# EAGLE schematic AxisNT_RF_PA (EAGLE 7.4.0)
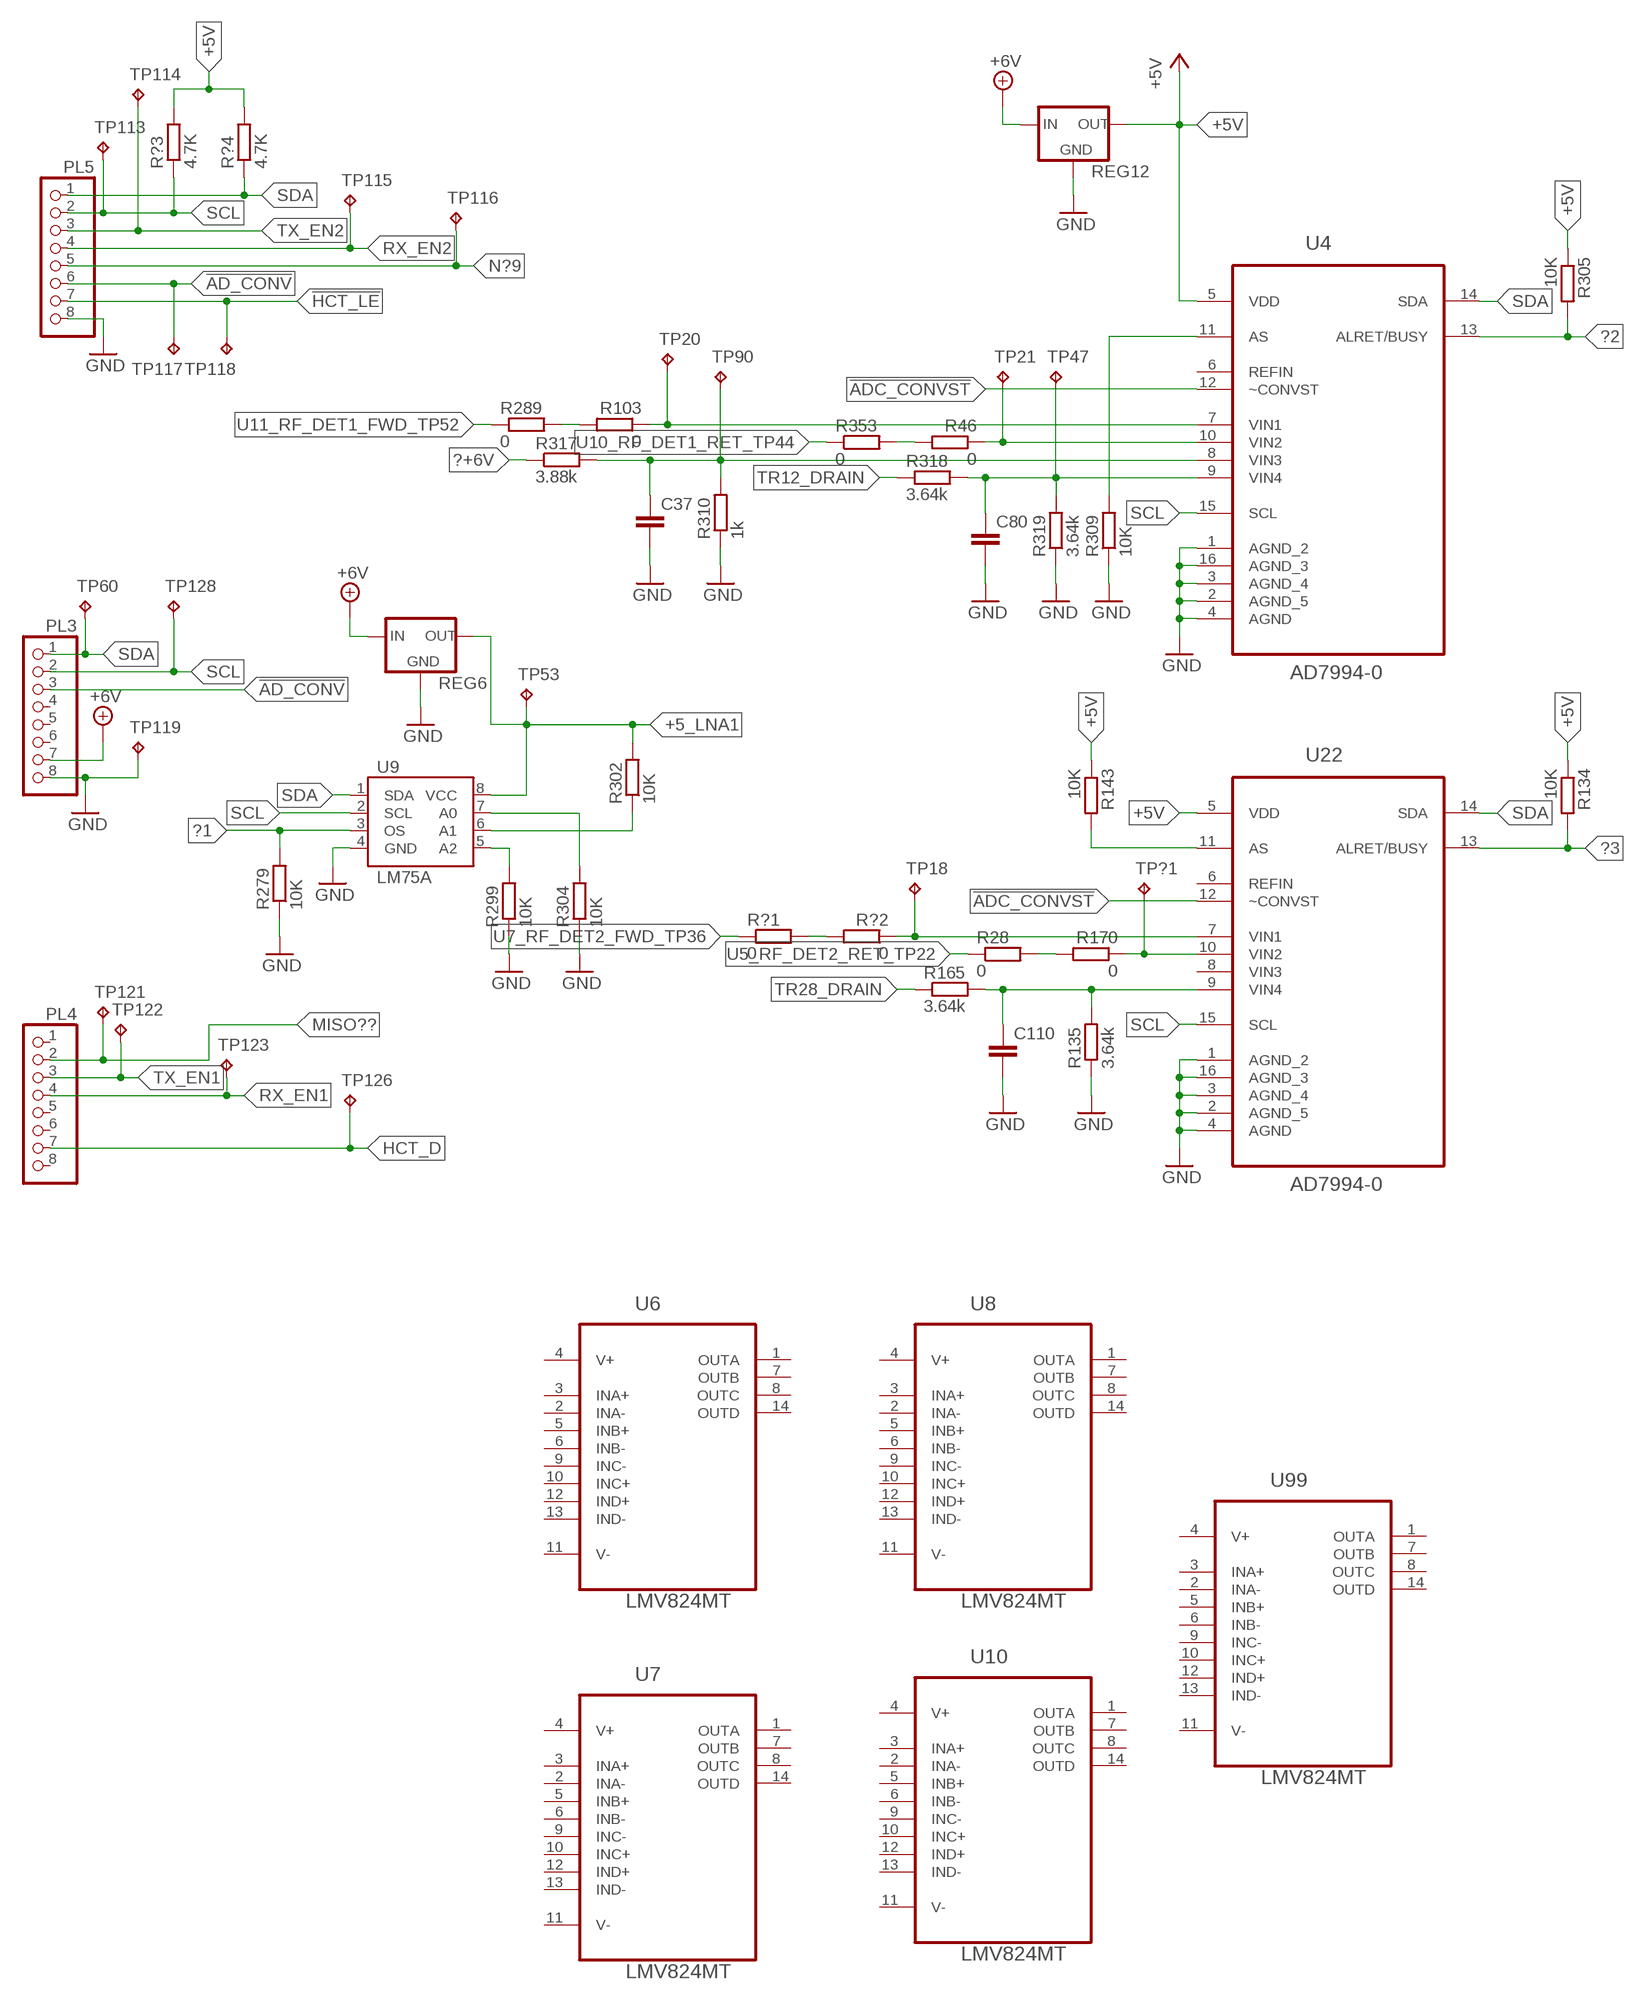
[diagram p0: schematic, sheet 1, part 1 of 2]
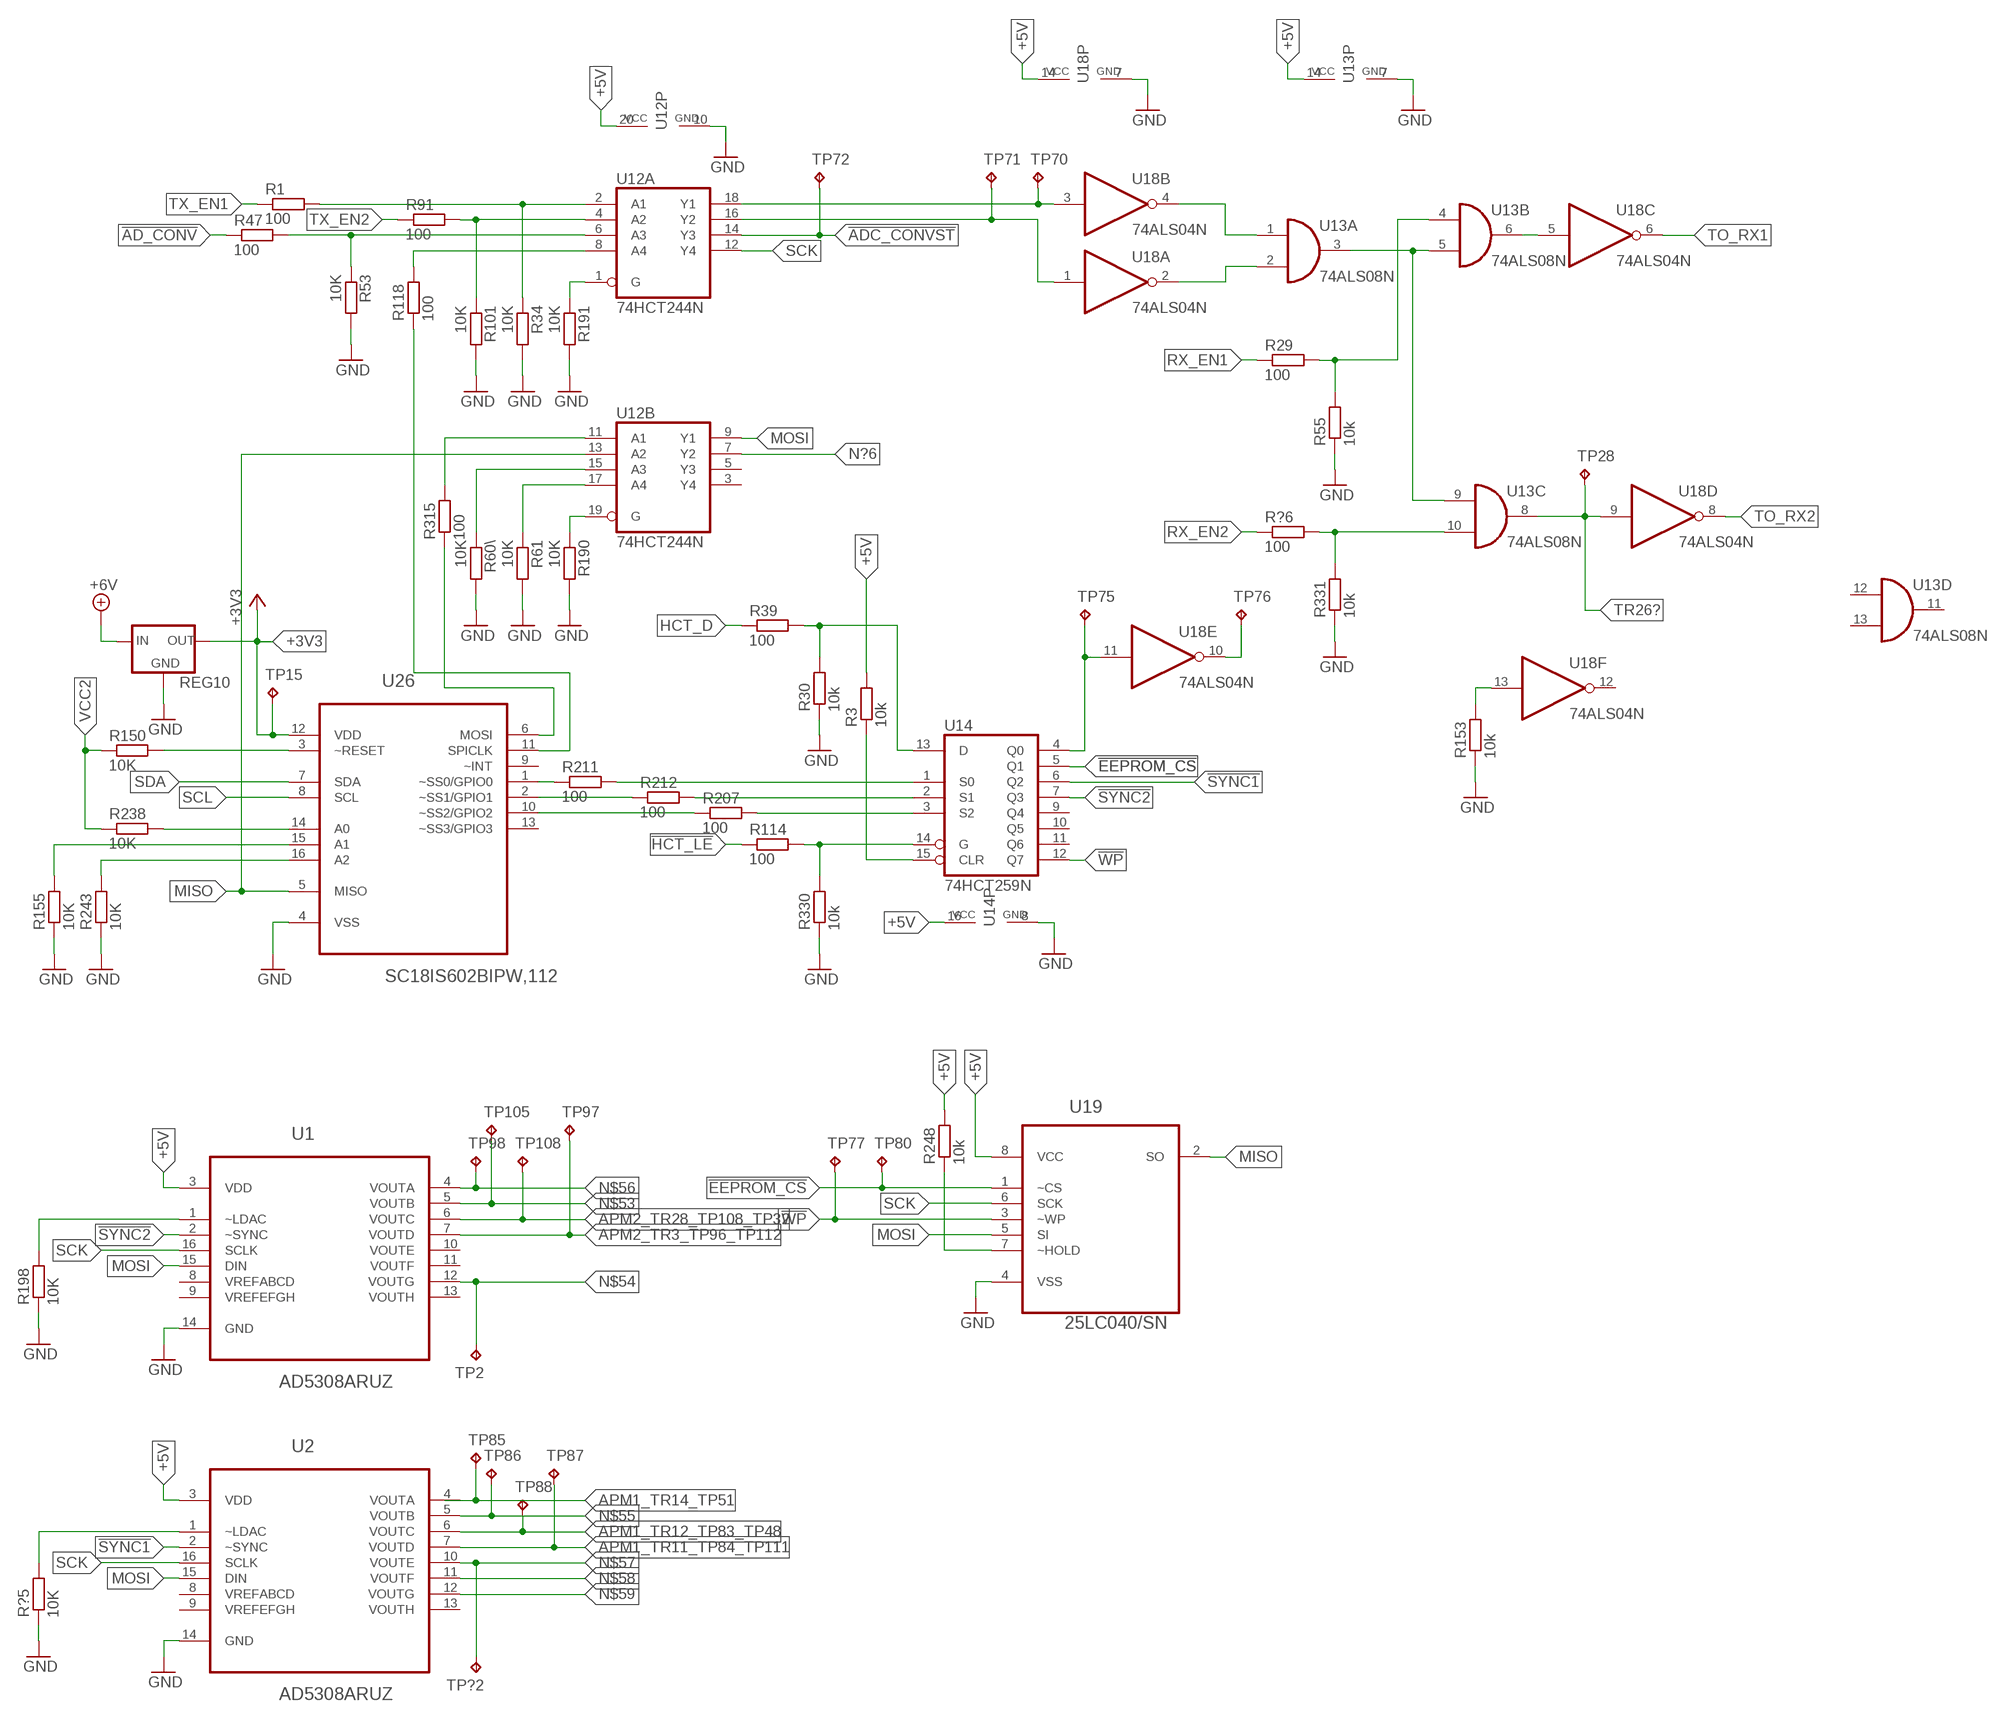
[diagram p1: schematic, sheet 1, part 2 of 2]

## Parts
C37  C-EUC0402  [C0402]
C80  C-EUC0402  [C0402]
C110  C-EUC0402  [C0402]
PL3  PINHD-1X8  [1X08]
PL4  PINHD-1X8  [1X08]
PL5  PINHD-1X8  [1X08]
R1  100  R-EU_R0402  [R0402]
R3  10k  R-EU_R0402  [R0402]
R28  0  R-EU_R0402  [R0402]
R29  100  R-EU_R0402  [R0402]
R30  10k  R-EU_R0402  [R0402]
R34  10K  R-EU_R0402  [R0402]
R39  100  R-EU_R0402  [R0402]
R46  0  R-EU_R0402  [R0402]
R47  100  R-EU_R0402  [R0402]
R53  10K  R-EU_R0402  [R0402]
R55  10k  R-EU_R0402  [R0402]
R60\  10K  R-EU_R0402  [R0402]
R61  10K  R-EU_R0402  [R0402]
R91  100  R-EU_R0402  [R0402]
R101  10K  R-EU_R0402  [R0402]
R103  0  R-EU_R0402  [R0402]
R114  100  R-EU_R0402  [R0402]
R118  100  R-EU_R0402  [R0402]
R134  10K  R-EU_R0402  [R0402]
R135  3.64k  R-EU_R0402  [R0402]
R143  10K  R-EU_R0402  [R0402]
R150  10K  R-EU_R0402  [R0402]
R153  10k  R-EU_R0402  [R0402]
R155  10K  R-EU_R0402  [R0402]
R165  3.64k  R-EU_R0402  [R0402]
R170  0  R-EU_R0402  [R0402]
R190  10K  R-EU_R0402  [R0402]
R191  10K  R-EU_R0402  [R0402]
R198  10K  R-EU_R0402  [R0402]
R207  100  R-EU_R0402  [R0402]
R211  100  R-EU_R0402  [R0402]
R212  100  R-EU_R0402  [R0402]
R238  10K  R-EU_R0402  [R0402]
R243  10K  R-EU_R0402  [R0402]
R248  10k  R-EU_R0402  [R0402]
R279  10K  R-EU_R0402  [R0402]
R289  0  R-EU_R0402  [R0402]
R299  10K  R-EU_R0402  [R0402]
R302  10K  R-EU_R0402  [R0402]
R304  10K  R-EU_R0402  [R0402]
R305  10K  R-EU_R0402  [R0402]
R309  10K  R-EU_R0402  [R0402]
R310  1k  R-EU_R0402  [R0402]
R315  100  R-EU_R0402  [R0402]
R317  3.88k  R-EU_R0402  [R0402]
R318  3.64k  R-EU_R0402  [R0402]
R319  3.64k  R-EU_R0402  [R0402]
R330  10k  R-EU_R0402  [R0402]
R331  10k  R-EU_R0402  [R0402]
R353  0  R-EU_R0402  [R0402]
R?1  0  R-EU_R0402  [R0402]
R?2  0  R-EU_R0402  [R0402]
R?3  4.7K  R-EU_R0402  [R0402]
R?4  4.7K  R-EU_R0402  [R0402]
R?5  10K  R-EU_R0402  [R0402]
R?6  100  R-EU_R0402  [R0402]
REG6  78LXX  [78LXX]
REG10  78LXX  [78LXX]
REG12  78LXX  [78LXX]
TP2  TPB1,27  [B1,27]
TP15  TPB1,27  [B1,27]
TP18  TPB1,27  [B1,27]
TP20  TPB1,27  [B1,27]
TP21  TPB1,27  [B1,27]
TP28  TPB1,27  [B1,27]
TP47  TPB1,27  [B1,27]
TP53  TPB1,27  [B1,27]
TP60  TPB1,27  [B1,27]
TP70  TPB1,27  [B1,27]
TP71  TPB1,27  [B1,27]
TP72  TPB1,27  [B1,27]
TP75  TPB1,27  [B1,27]
TP76  TPB1,27  [B1,27]
TP77  TPB1,27  [B1,27]
TP80  TPB1,27  [B1,27]
TP85  TPB1,27  [B1,27]
TP86  TPB1,27  [B1,27]
TP87  TPB1,27  [B1,27]
TP88  TPB1,27  [B1,27]
TP90  TPB1,27  [B1,27]
TP97  TPB1,27  [B1,27]
TP98  TPB1,27  [B1,27]
TP105  TPB1,27  [B1,27]
TP108  TPB1,27  [B1,27]
TP113  TPB1,27  [B1,27]
TP114  TPB1,27  [B1,27]
TP115  TPB1,27  [B1,27]
TP116  TPB1,27  [B1,27]
TP117  TPB1,27  [B1,27]
TP118  TPB1,27  [B1,27]
TP119  TPB1,27  [B1,27]
TP121  TPB1,27  [B1,27]
TP122  TPB1,27  [B1,27]
TP123  TPB1,27  [B1,27]
TP126  TPB1,27  [B1,27]
TP128  TPB1,27  [B1,27]
TP?1  TPB1,27  [B1,27]
TP?2  TPB1,27  [B1,27]
U1  AD5308ARUZ  [SOP65P640X120-16N]
U2  AD5308ARUZ  [SOP65P640X120-16N]
U4  AD7994-0  AD7993BRUZ-0  [SOP65P640X120-16N]
U6  LMV824MT  [SOP65P640X110-14N]
U7  LMV824MT  [SOP65P640X110-14N]
U8  LMV824MT  [SOP65P640X110-14N]
U9  LM75A  [SO8]
U10  LMV824MT  [SOP65P640X110-14N]
U12  74HCT244N  [DIL20]
U13  74ALS08N  [DIL14]
U14  74HCT259N  [DIL16]
U18  74ALS04N  [DIL14]
U19  25LC040/SN  [SOIC127P600X175-8N]
U22  AD7994-0  AD7993BRUZ-0  [SOP65P640X120-16N]
U26  SC18IS602BIPW,112  [SOP65P640X110-16N]
U99  LMV824MT  [SOP65P640X110-14N]

## Nets
!AD_CONV: PL3.3 PL5.6 R47.1 TP117.TP
!ADC_CONVST: TP72.TP U4.12(~CONVST) U12.14(A:Y3) U22.12(~CONVST)
!EEPROM_CS: TP80.TP U14.5(Q1) U19.1(~CS)
!HCT_LE: PL5.7 R114.1 TP118.TP
!SYNC1: U2.2(~SYNC) U14.6(Q2)
!SYNC2: U1.2(~SYNC) U14.7(Q3)
!WP: TP77.TP U14.12(Q7) U19.3(~WP)
+3V3: REG10.OUT TP15.TP U26.12(VDD)
+5_LNA1: R302.2 REG6.OUT TP53.TP U9.8(VCC)
+5V: R3.2 R134.1 R143.1 R248.2 R305.1 R?3.2 R?4.2 REG12.OUT U1.3(VDD) U2.3(VDD) U4.5(VDD) U12.20(P:VCC) U13.14(P:VCC) U14.16(VCC) U18.14(P:VCC) U19.8(VCC) U22.5(VDD)
+7V: PL3.7 REG6.IN REG10.IN REG12.IN ; supply symbol labelled +6V
?1: R279.2 U9.3(OS)
?2: R305.2 U4.13(ALRET/BUSY)
?3: R134.2 U22.13(ALRET/BUSY)
?+6V: R317.1
APM1_TR11_TP84_TP111: TP87.TP U2.7(VOUTD)
APM1_TR12_TP83_TP48: TP88.TP U2.6(VOUTC)
APM1_TR14_TP51: TP85.TP
APM2_TR3_TP96_TP112: TP97.TP U1.7(VOUTD)
APM2_TR28_TP108_TP32: TP108.TP U1.6(VOUTC)
GND: C37.2 C80.2 C110.2 PL3.8 PL5.8 R30.1 R34.2 R53.2 R55.1 R60\.2 R61.2 R101.2 R135.1 R153.1 R155.1 R190.2 R191.2 R198.1 R243.1 R279.1 R299.1 R304.1 R309.1 R310.1 R319.1 R330.1 R331.1 R?5.1 REG6.GND REG10.GND REG12.GND TP119.TP U1.14(GND) U2.14(GND) U4.1(AGND_2) U4.2(AGND_5) U4.3(AGND_4) U4.4(AGND) U4.16(AGND_3) U9.4(GND) U12.10(P:GND) U13.7(P:GND) U14.8(GND) U18.7(P:GND) U19.4(VSS) U22.1(AGND_2) U22.2(AGND_5) U22.3(AGND_4) U22.4(AGND) U22.16(AGND_3) U26.4(VSS)
HCT_D: PL4.7 R39.1 TP126.TP
MISO: U12.13(B:A2) U19.2(SO) U26.5(MISO)
MISO??: PL4.2 TP121.TP
MOSI: U1.15(DIN) U2.15(DIN) U12.9(B:Y1) U19.5(SI)
N$1: R1.2 R34.1 U12.2(A:A1)
N$2: R143.2 U22.11(AS)
N$3: R299.2 U9.5(A2)
N$4: R304.2 U9.7(A0)
N$5: R302.1 U9.6(A1)
N$6: R309.2 U4.11(AS)
N$7: C80.1 R318.2 R319.2 TP47.TP U4.9(VIN4)
N$8: R46.1 TP21.TP U4.10(VIN2)
N$9: R46.2 R353.2
N$10: C37.1 R310.2 R317.2 TP90.TP U4.8(VIN3)
N$11: R103.1 TP20.TP U4.7(VIN1)
N$12: R103.2 R289.2
N$13: C110.1 R135.2 R165.2 U22.9(VIN4)
N$14: R170.1 TP?1.TP U22.10(VIN2)
N$15: R28.2 R170.2
N$16: R191.1 U12.1(A:G)
N$17: R?2.1 TP18.TP U22.7(VIN1)
N$18: R?1.2 R?2.2
N$19: R190.1 U12.19(B:G)
N$20: R238.2 U26.14(A0)
N$21: R155.2 U26.15(A1)
N$22: R243.2 U26.16(A2)
N$23: R211.1 U26.1(~SS0/GPIO0)
N$24: R211.2 U14.1(S0)
N$25: R212.2 U14.2(S1)
N$26: R212.1 U26.2(~SS1/GPIO1)
N$27: R207.2 U14.3(S2)
N$28: R207.1 U26.10(~SS2/GPIO2)
N$29: R114.2 R330.2 U14.14(G)
N$30: R3.1 U14.15(CLR)
N$31: R30.2 R39.2 U14.13(D)
N$32: R150.2 U26.3(~RESET)
N$33: R248.1 U19.7(~HOLD)
N$34: R118.2 U12.8(A:A4)
N$35: R118.1 U26.11(SPICLK)
N$36: R?5.2 U2.1(~LDAC)
N$37: R198.2 U1.1(~LDAC)
N$38: R315.2 U12.11(B:A1)
N$39: R315.1 U26.6(MOSI)
N$40: R61.1 U12.17(B:A4)
N$41: R91.2 R101.1 U12.4(A:A2)
N$42: TP70.TP U12.18(A:Y1) U18.3(B:I)
N$43: TP71.TP U12.16(A:Y2) U18.1(A:I)
N$44: R47.2 R53.1 U12.6(A:A3)
N$45: R60\.1 U12.15(B:A3)
N$46: U13.2(A:I1) U18.2(A:O)
N$47: U13.1(A:I0) U18.4(B:O)
N$48: U13.6(B:O) U18.5(C:I)
N$49: U13.3(A:O) U13.5(B:I1) U13.9(C:I0)
N$50: R29.2 R55.2 U13.4(B:I0)
N$51: R331.2 R?6.2 U13.10(C:I1)
N$52: R153.2 U18.13(F:I)
N$53: TP105.TP U1.5(VOUTB)
N$54: TP2.TP U1.12(VOUTG)
N$55: TP86.TP U2.5(VOUTB)
N$56: TP98.TP U1.4(VOUTA)
N$57: TP?2.TP U2.10(VOUTE)
N$58: U2.11(VOUTF)
N$59: U2.12(VOUTG)
N$60: TP75.TP U14.4(Q0) U18.11(E:I)
N$61: TP76.TP U18.10(E:O)
N?6: U12.7(B:Y2)
N?9: PL5.5 TP116.TP
RX_EN1: PL4.4 R29.1 TP123.TP
RX_EN2: PL5.4 R?6.1 TP115.TP
SCK: U1.16(SCLK) U2.16(SCLK) U12.12(A:Y4) U19.6(SCK)
SCL: PL3.2 PL5.2 R?3.1 TP113.TP TP128.TP U4.15(SCL) U9.2(SCL) U22.15(SCL) U26.8(SCL)
SDA: PL3.1 PL5.1 R?4.1 TP60.TP U4.14(SDA) U9.1(SDA) U22.14(SDA) U26.7(SDA)
TO_RX1: U18.6(C:O)
TO_RX2: U18.8(D:O)
TR12_DRAIN: R318.1
TR26?: TP28.TP U13.8(C:O) U18.9(D:I)
TR28_DRAIN: R165.1
TX_EN1: PL4.3 R1.1 TP122.TP
TX_EN2: PL5.3 R91.1 TP114.TP
U5_RF_DET2_RET_TP22: R28.1
U7_RF_DET2_FWD_TP36: R?1.1
U10_RF_DET1_RET_TP44: R353.1
U11_RF_DET1_FWD_TP52: R289.1
VCC2: R150.1 R238.1
Unconnected: PL3.4 PL3.5 PL3.6 PL4.1 PL4.5 PL4.6 PL4.8 U1.8(VREFABCD) U1.9(VREFEFGH) U1.10(VOUTE) U1.11(VOUTF) U1.13(VOUTH) U2.4(VOUTA) U2.8(VREFABCD) U2.9(VREFEFGH) U2.13(VOUTH) U4.6(REFIN) U6.1(OUTA) U6.2(INA-) U6.3(INA+) U6.5(INB+) U6.6(INB-) U6.7(OUTB) U6.8(OUTC) U6.9(INC-) U6.10(INC+) U6.12(IND+) U6.13(IND-) U6.14(OUTD) U7.1(OUTA) U7.2(INA-) U7.3(INA+) U7.5(INB+) U7.6(INB-) U7.7(OUTB) U7.8(OUTC) U7.9(INC-) U7.10(INC+) U7.12(IND+) U7.13(IND-) U7.14(OUTD) U8.1(OUTA) U8.2(INA-) U8.3(INA+) U8.5(INB+) U8.6(INB-) U8.7(OUTB) U8.8(OUTC) U8.9(INC-) U8.10(INC+) U8.12(IND+) U8.13(IND-) U8.14(OUTD) U10.1(OUTA) U10.2(INA-) U10.3(INA+) U10.5(INB+) U10.6(INB-) U10.7(OUTB) U10.8(OUTC) U10.9(INC-) U10.10(INC+) U10.12(IND+) U10.13(IND-) U10.14(OUTD) U12.3(B:Y4) U12.5(B:Y3) U13.11(D:O) U13.12(D:I0) U13.13(D:I1) U14.9(Q4) U14.10(Q5) U14.11(Q6) U18.12(F:O) U22.6(REFIN) U22.8(VIN3) U26.9(~INT) U26.13(~SS3/GPIO3) U99.1(OUTA) U99.2(INA-) U99.3(INA+) U99.5(INB+) U99.6(INB-) U99.7(OUTB) U99.8(OUTC) U99.9(INC-) U99.10(INC+) U99.12(IND+) U99.13(IND-) U99.14(OUTD)

## Power pins joined to a net without a drawn wire
V+: U6.4(V+) U7.4(V+) U8.4(V+) U10.4(V+) U99.4(V+)
V-: U6.11(V-) U7.11(V-) U8.11(V-) U10.11(V-) U99.11(V-)

## Library data of the parts
C37 C80 C110 = rcl:C-EU: CAPACITOR, European symbol
PL3-PL5 = pinhead:PINHD-1X8: PIN HEADER
R1 R3 R28-R30 R34 R39 R46 R47 R53 R55 R60\ R61 R91 R101 R103 R114 R118 R134 R135 R143 R150 R153 R155 R165 R170 R190 R191 R198 R207 R211 R212 R238 R243 R248 R279 R289 R299 R302 R304 R305 R309 R310 R315 R317-R319 R330 R331 R353 R?1-R?6 = rcl:R-EU_: RESISTOR, European symbol
REG6 REG10 REG12 = v-reg:78LXX: VOLTAGE REGULATOR
TP2 TP15 TP18 TP20 TP21 TP28 TP47 TP53 TP60 TP70-TP72 TP75-TP77 TP80 TP85-TP88 TP90 TP97 TP98 TP105 TP108 TP113-TP119 TP121-TP123 TP126 TP128 TP?1 TP?2 = testpad:TP: Test pad
U1 U2 = Analog Devices_By_element14_Batch_1:AD5308ARUZ: 2.5 V to 5.5 V Octal Voltage Output 8-/10-/12-Bit DACs in 16-Lead TSSOP; MPN: AD5308ARUZ; OC_FARNELL: 1423753; OC_NEWARK: 59K3883; PACKAGE: TSSOP-16; SUPPLIER: Analog Devices
U4 U22 = Analog Devices_By_element14_Batch_1:AD7993BRUZ-0: ADC; MPN: AD7993BRUZ-0; OC_FARNELL: 1078309; OC_NEWARK: 59K6101; PACKAGE: TSSOP-16; SUPPLIER: Analog Devices
U6-U8 U10 U99 = NSC_By_element14_Batch_1.1:LMV824MT: Op Amps; MPN: LMV824MT; OC_FARNELL: -; OC_NEWARK: 41K3206; PACKAGE: TSSOP-14; SUPPLIER: NationalSemiconductor
U9 = nxp:LM75A
U12 = 74xx-eu:74*244: Octal BUFFER and LINE DRIVER, 3-state
U13 = 74xx-eu:74*08: Quad 2-input AND gate
U14 = 74xx-eu:74*259: 8-bit addressable LATCH
U18 = 74xx-eu:74*04: Hex INVERTER
U19 = Microchip_By_element14_Batch_1:25LC040/SN: 4K SPI Bus Serial EEPROM; MPN: 25LC040/SN; OC_FARNELL: 1084247; OC_NEWARK: 89C9834; PACKAGE: SOIC-8; SUPPLIER: MICROCHIP
U26 = NXP_By_element14_Batch_1:SC18IS602BIPW,112: I2C-bus to SPI bridge; MPN: SC18IS602BIPW,112; OC_FARNELL: -; OC_NEWARK: 70R9018; PACKAGE: TSSOP-16; SUPPLIER: NXP